# Altium schematic sheet [03] - 28PINS SCHEMATIC.SchDoc
size A2; PageSetup: Record=PageOptions|CenterHorizontal=True|CenterVertical=True|PrintScale=0.73|XCorrection=1.00|YCorrection=1.00|PrintKind=0|BorderSize=5000000|LeftOffset=0|BottomOffset=0|Orientation=2|PaperLength=1000|PaperWidth=1000|Scale=100|PaperSource=7|PrintQuality=-3|MediaType=1|DitherType=10|PrintScaleMode=1|PaperKind=A3|PaperIndex=8
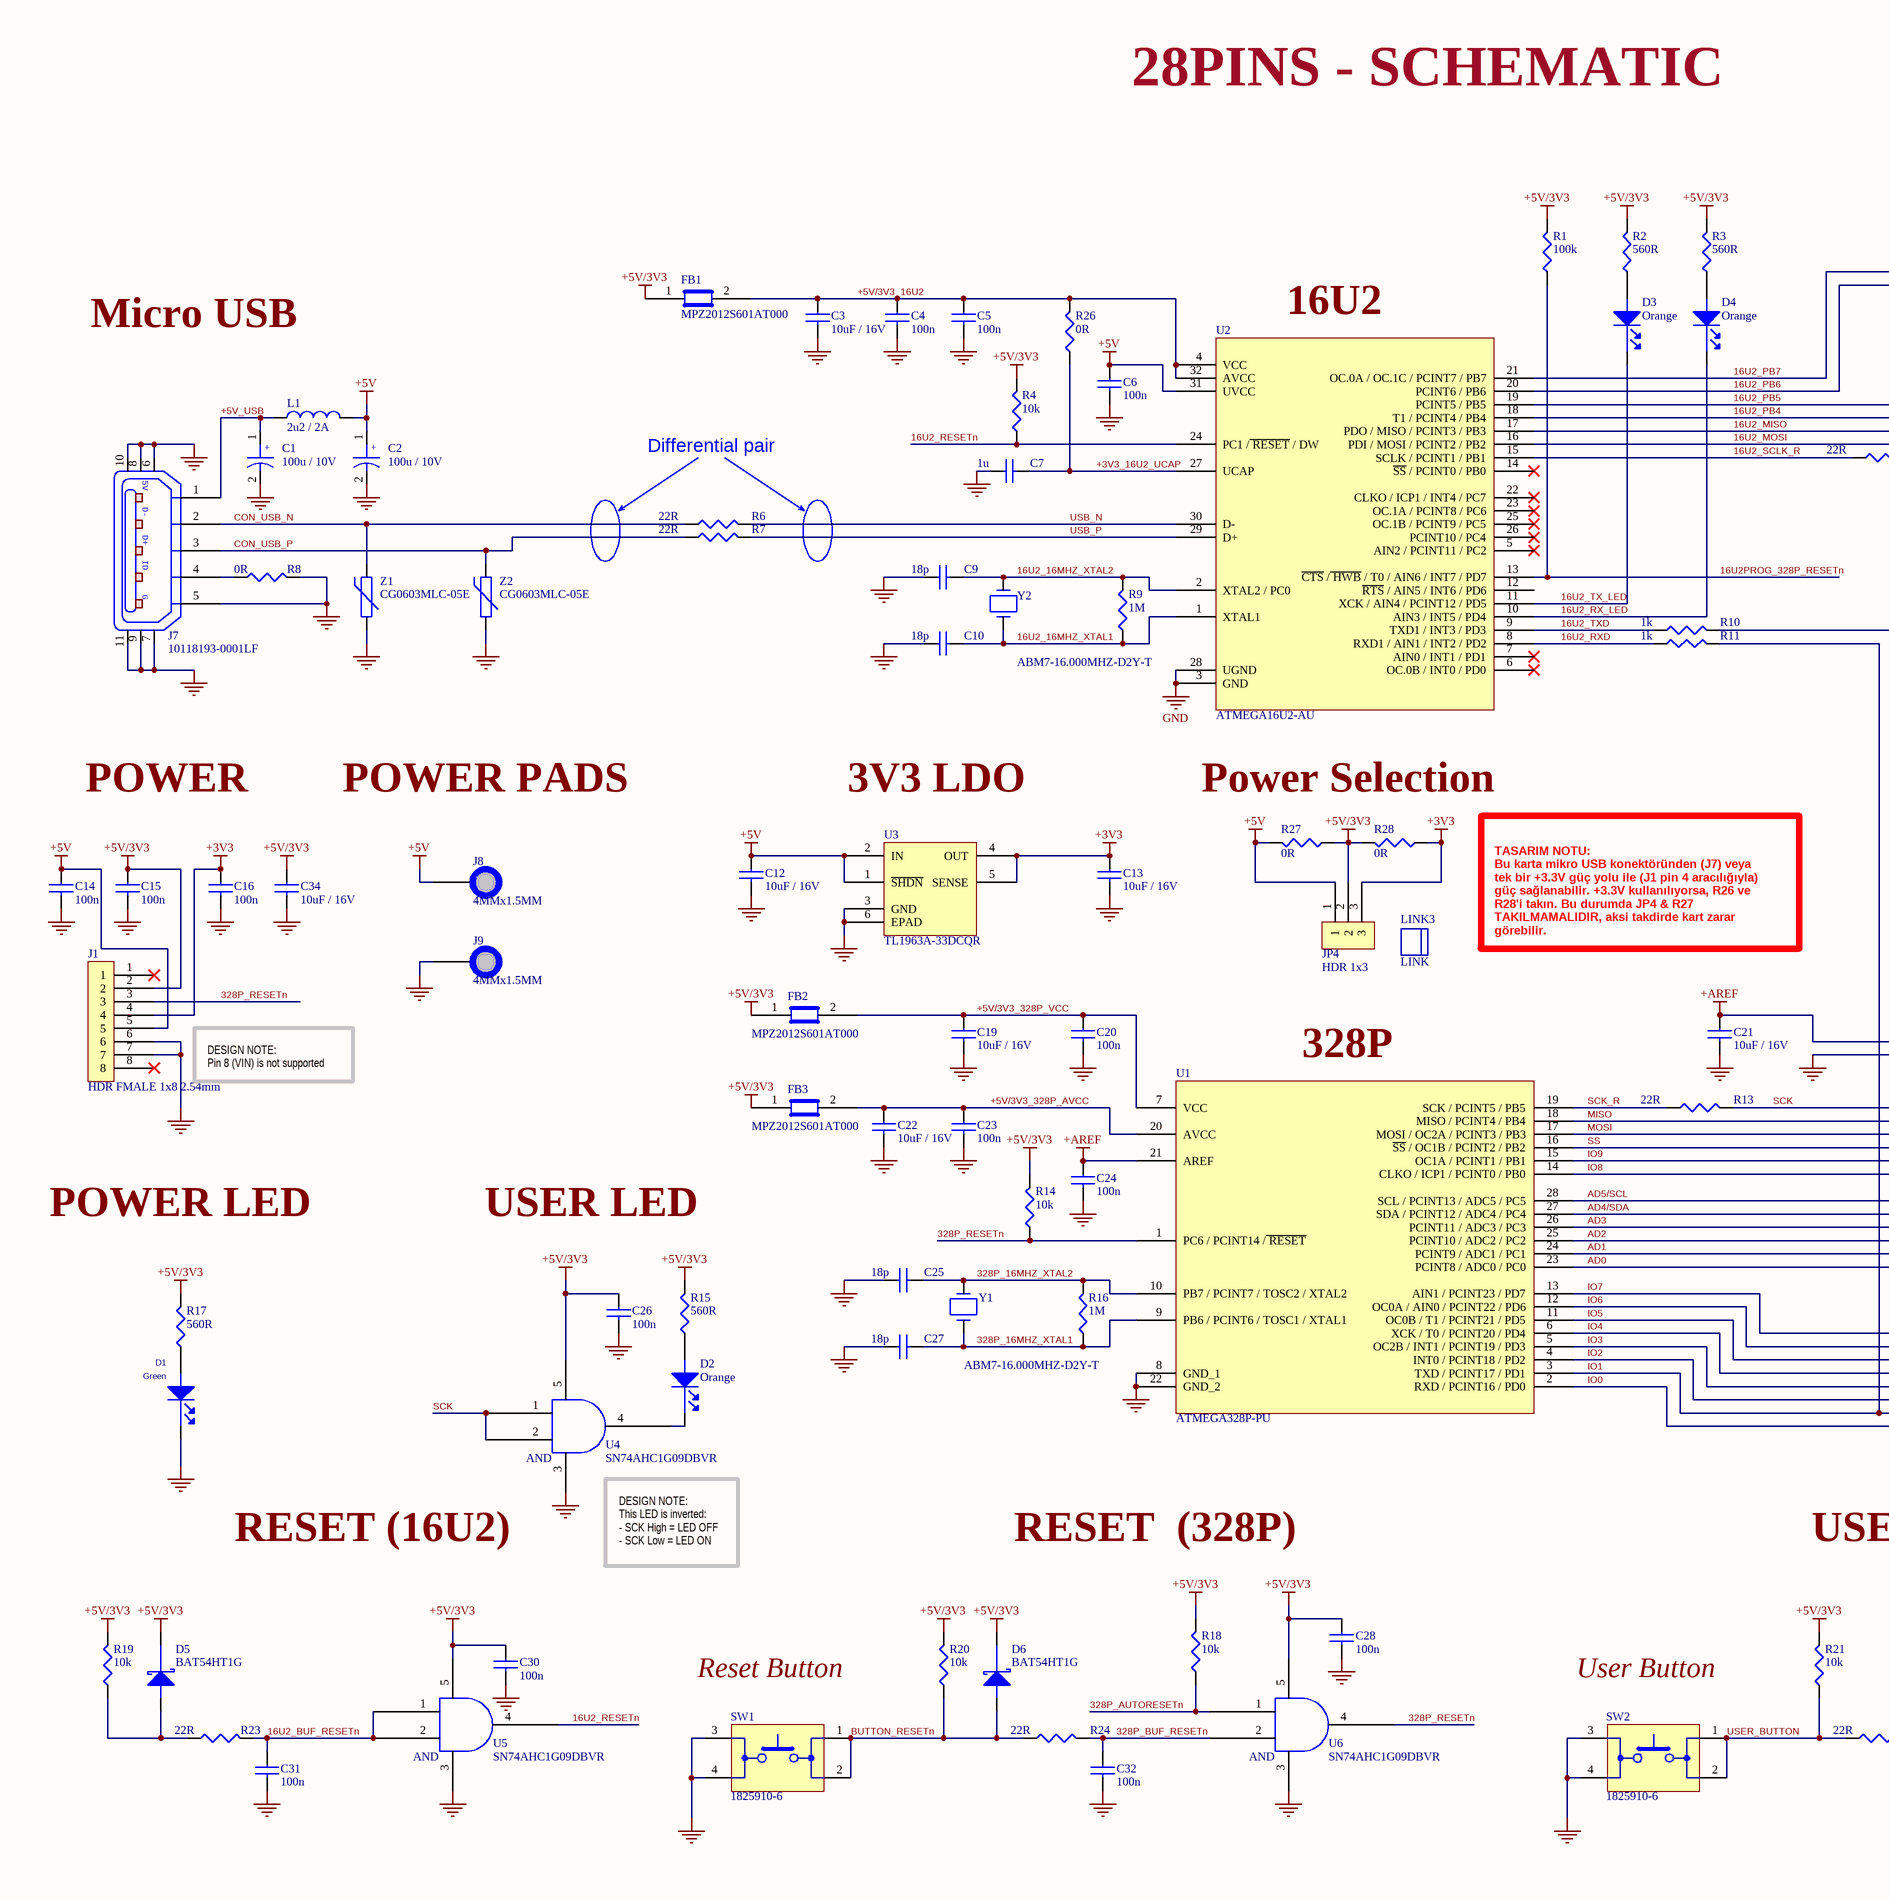
[diagram p0: [03] - 28PINS SCHEMATIC.SchDoc, left]
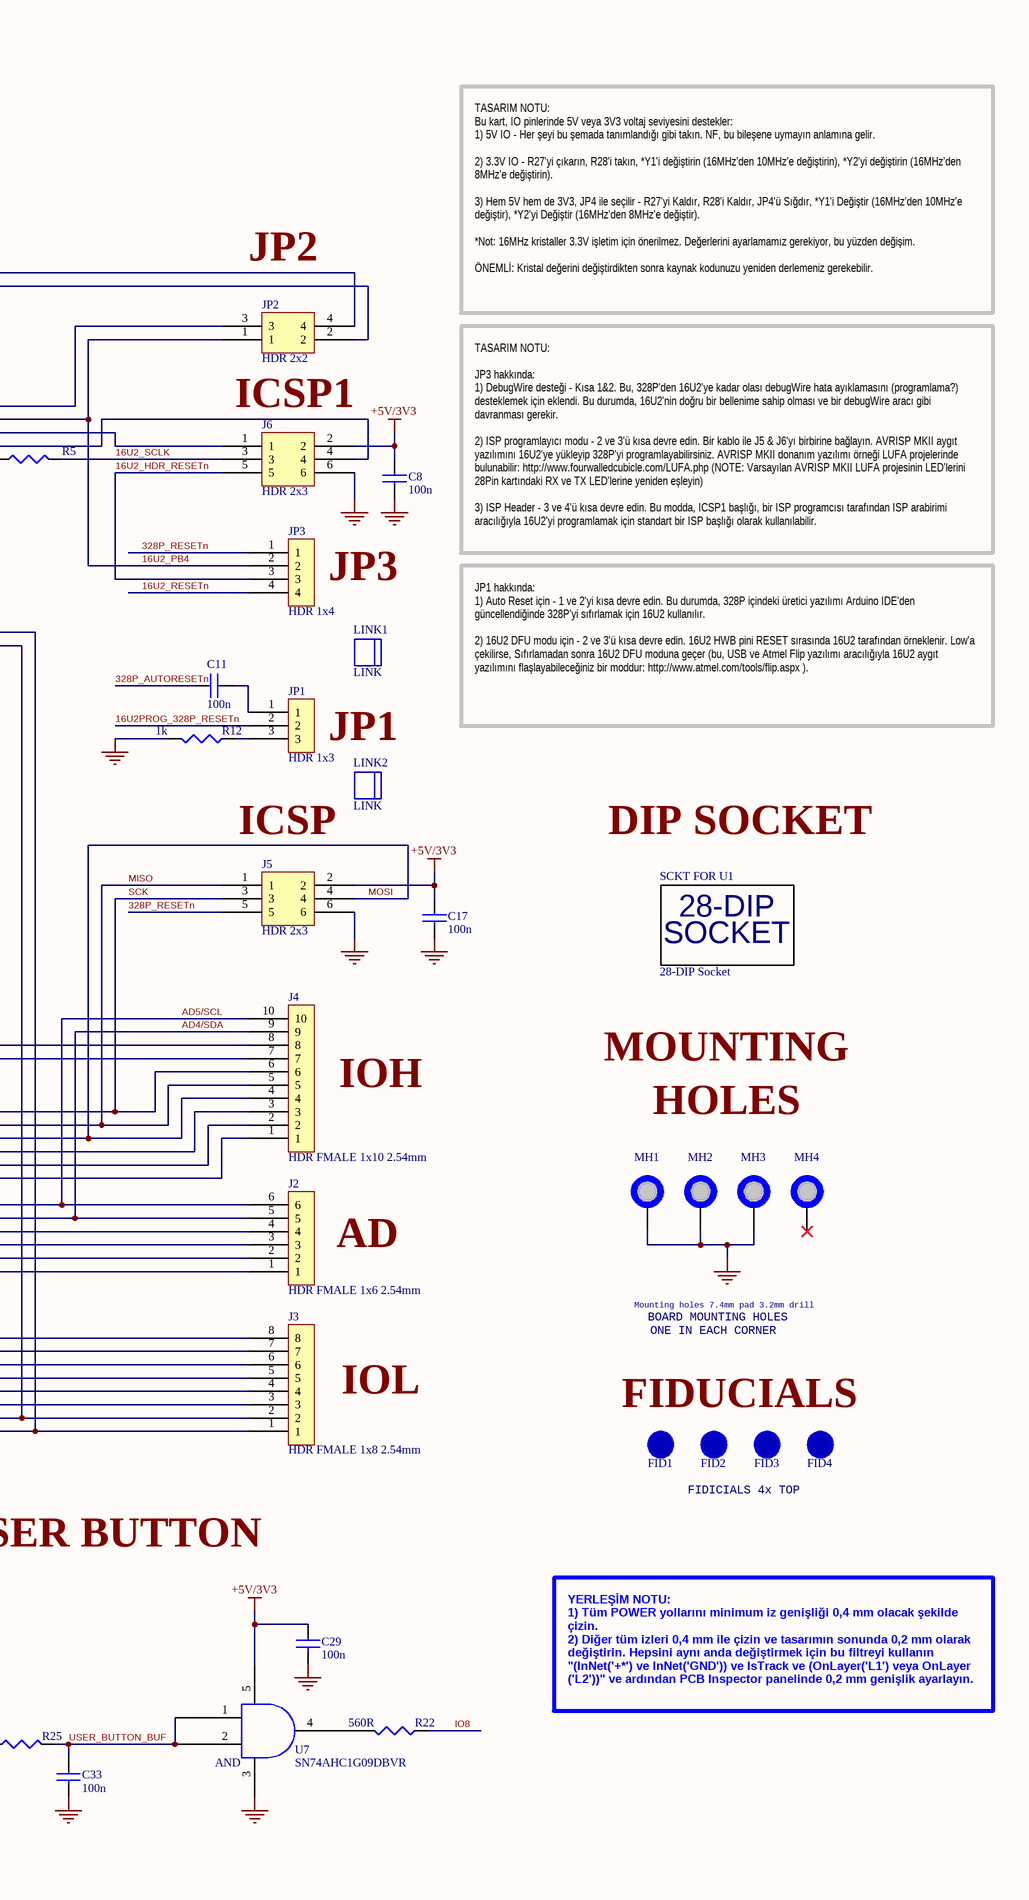
[diagram p1: [03] - 28PINS SCHEMATIC.SchDoc, right]

## Parts
C1  100u / 10V  [C_ALU_C_SIZE]
C2  100u / 10V  [C_ALU_C_SIZE]
C3  10uF / 16V  [C0805]
C4  100n  [C0805]
C5  100n  [C0805]
C6  100n  [C0805]
C7  1u  [C0805]
C8  100n  [C0805]
C9  18p  [C0805]
C10  18p  [C0805]
C11  100n  [C0805]
C12  10uF / 16V  [C0805]
C13  10uF / 16V  [C0805]
C14  100n  [C0805]
C15  100n  [C0805]
C16  100n  [C0805]
C17  100n  [C0805]
C19  10uF / 16V  [C0805]
C20  100n  [C0805]
C21  10uF / 16V  [C0805]
C22  10uF / 16V  [C0805]
C23  100n  [C0805]
C24  100n  [C0805]
C25  18p  [C0805]
C26  100n  [C0805]
C27  18p  [C0805]
C28  100n  [C0805]
C29  100n  [C0805]
C30  100n  [C0805]
C31  100n  [C0805]
C32  100n  [C0805]
C33  100n  [C0805]
C34  10uF / 16V  [C0805]
D1  Green  [LED_0603]
D2  Orange  [LED_0603]
D3  Orange  [LED_0603]
D4  Orange  [LED_0603]
D5  BAT54HT1G  [SOD323]
D6  BAT54HT1G  [SOD323]
FB1  MPZ2012S601AT000  [C0805]
FB2  MPZ2012S601AT000  [C0805]
FB3  MPZ2012S601AT000  [C0805]
FID1  FID_1MMC  [FID_40X120D]  (value not drawn)  (no BOM)
FID2  FID_1MMC  [FID_40X120D]  (value not drawn)  (no BOM)
FID3  FID_1MMC  [FID_40X120D]  (value not drawn)  (no BOM)
FID4  FID_1MMC  [FID_40X120D]  (value not drawn)  (no BOM)
J1  HDR FMALE 1x8 2.54mm  [Hdr_Female_1x8_2.54mm]
J2  HDR FMALE 1x6 2.54mm  [Hdr_Female_1x6_2.54mm]
J3  HDR FMALE 1x8 2.54mm  [Hdr_Female_1x8_2.54mm]
J4  HDR FMALE 1x10 2.54mm  [Hdr_Female_1x10_2.54mm]
J5  HDR 2x3  [HDR_2x3_2.54MM]
J6  HDR 2x3  [HDR_2x3_2.54MM]
J7  10118193-0001LF  [10118193]
J8  4MMx1.5MM  [PAD_WITH_HOLE_4MMx1.5MM]  (no BOM)
J9  4MMx1.5MM  [PAD_WITH_HOLE_4MMx1.5MM]  (no BOM)
JP1  HDR 1x3  [Hdr_1x3_2.54mm]
JP2  HDR 2x2  [HDR_2x2_2.54MM]
JP3  HDR 1x4  [HDR_1x4_2.54MM]
JP4  HDR 1x3  [Hdr_1x3_2.54mm]
L1  2u2 / 2A  [C1210_IND]
LINK1  LINK  (mechanical)
LINK2  LINK  (mechanical)
LINK3  LINK  (mechanical)
MH1  MH_7.4MMC_3.2MMD  [MH_7.4MMD_3.2MMD]  (value not drawn)  (no BOM)
MH2  MH_7.4MMC_3.2MMD  [MH_7.4MMD_3.2MMD]  (value not drawn)  (no BOM)
MH3  MH_7.4MMC_3.2MMD  [MH_7.4MMD_3.2MMD]  (value not drawn)  (no BOM)
MH4  MH_7.4MMNC_3.2MMD  [MH_7.4MMD_3.2MMD_NON_COPPER_NPTH]  (value not drawn)  (no BOM)
R1  100k  [R0805]
R2  560R  [R0805]
R3  560R  [R0805]
R4  10k  [R0805]
R5  22R  [R0805]
R6  22R  [R0805]
R7  22R  [R0805]
R8  0R  [R0805]
R9  1M  [R0805]
R10  1k  [R0805]
R11  1k  [R0805]
R12  1k  [R0805]
R13  22R  [R0805]
R14  10k  [R0805]
R15  560R  [R0805]
R16  1M  [R0805]
R17  560R  [R0805]
R18  10k  [R0805]
R19  10k  [R0805]
R20  10k  [R0805]
R21  10k  [R0805]
R22  560R  [R0805]
R23  22R  [R0805]
R24  22R  [R0805]
R25  22R  [R0805]
R26  0R  [R0805]
R27  0R  [R0805]
R28  0R  [R0805]
SCKT_FOR_U1  28-DIP Socket  [28_DIP_7.62mm_SOCKET]
SW1  1825910-6  [1825910-6]
SW2  1825910-6  [1825910-6]
U1  ATMEGA328P-PU  [28_DIP_7.62mm]
U2  ATMEGA16U2-AU  [TQFP32]
U3  TL1963A-33DCQR  [DCQ (R-PDSO-G6)]
U4  SN74AHC1G09DBVR  [DBV_SOT_23_5]
U5  SN74AHC1G09DBVR  [DBV_SOT_23_5]
U6  SN74AHC1G09DBVR  [DBV_SOT_23_5]
U7  SN74AHC1G09DBVR  [DBV_SOT_23_5]
Y1  ABM7-16.000MHZ-D2Y-T  [ABM7_v1_1_BIG]
Y2  ABM7-16.000MHZ-D2Y-T  [ABM7_v1_1_BIG]
Z1  CG0603MLC-05E  [R0603]
Z2  CG0603MLC-05E  [R0603]

## Nets
+3V3: C13.1 C16.1 J1.4 JP4.3 R28.1 U3.4(OUT) U3.5(SENSE)
+5V: C2.1 C6.1 C12.1 C14.1 J1.5 J8.1 JP4.1 L1.2 R27.2 U2.31(UVCC) U3.1(~{SHDN}) U3.2(IN)
+5V/3V3: C8.1 C15.1 C17.1 C26.1 C28.1 C29.1 C30.1 C34.1 D5.1(Cathode) D6.1(Cathode) FB1.1 FB2.1 FB3.1 J1.2 J5.2 J6.2 JP4.2 R1.2 R2.2 R3.2 R4.2 R14.2 R15.2 R17.2 R18.2 R19.2 R20.2 R21.2 R27.1 R28.2 U4.5(VCC) U5.5(VCC) U6.5(VCC) U7.5(VCC)
+AREF: C21.1 C24.1 J4.8 U1.21(AREF)
GND: C1.2 C2.2 C3.2 C4.2 C5.2 C6.2 C7.1 C8.2 C9.1 C10.1 C12.2 C13.2 C14.2 C15.2 C16.2 C17.2 C19.2 C20.2 C21.2 C22.2 C23.2 C24.2 C25.1 C26.2 C27.1 C28.2 C29.2 C30.2 C31.2 C32.2 C33.2 C34.2 D1.1(cathode) J1.6 J1.7 J4.7 J5.6 J6.6 J7.5(P5) J7.6 J7.7 J7.8 J7.9 J7.10 J7.11 J9.1 MH1.1 MH2.1 MH3.1 R8.2 R12.2 SW1.3(MECH1) SW1.4(MECH2) SW2.3(MECH1) SW2.4(MECH2) U1.8(GND_1) U1.22(GND_2) U2.3(GND) U2.28(UGND) U3.3(GND) U3.6(EPAD) U4.3(GND) U5.3(GND) U6.3(GND) U7.3(GND) Z1.1 Z2.1
16U2_16MHZ_XTAL1: C10.2 R9.1 U2.1(XTAL1) Y2.1
16U2_16MHZ_XTAL2: C9.2 R9.2 U2.2(XTAL2_/_PC0) Y2.2
16U2_BUF_RESETn: C31.1 R23.2 U5.1(A) U5.2(B)
16U2_HDR_RESETn: J6.5 JP3.3
16U2_MISO: J6.1 U2.17(PDO_/_MISO_/_PCINT3_/_PB3)
16U2_MOSI: J6.4 U2.16(PDI_/_MOSI_/_PCINT2_/_PB2)
16U2_PB4: JP2.1 JP3.2 U2.18(T1_/_PCINT4_/_PB4)
16U2_PB5: JP2.3 U2.19(PCINT5_/_PB5)
16U2_PB6: JP2.2 U2.20(PCINT6_/_PB6)
16U2_PB7: JP2.4 U2.21(OC.0A_/_OC.1C_/_PCINT7_/_PB7)
16U2_RESETn: JP3.4 R4.1 U2.24(PC1_/~{_RESET}_/_DW) U5.4(Y)
16U2_RX_LED: D4.1(cathode) U2.10(AIN3_/_INT5_/_PD4)
16U2_RXD: R11.1 U2.8(RXD1_/_AIN1_/_INT2_/_PD2)
16U2_SCLK: J6.3 R5.2
16U2_SCLK_R: R5.1 U2.15(SCLK_/_PCINT1_/_PB1)
16U2_TX_LED: D3.1(cathode) U2.11(XCK_/_AIN4_/_PCINT12_/_PD5)
16U2_TXD: R10.1 U2.9(TXD1_/_INT3_/_PD3)
16U2PROG_328P_RESETn: JP1.2 R1.1 U2.13(~{CTS}_/~{_HWB}_/_T0_/_AIN6_/_INT7_/_PD7)
328P_16MHZ_XTAL1: C27.2 R16.1 U1.9(PB6_/_PCINT6_/_TOSC1_/_XTAL1) Y1.1
328P_16MHZ_XTAL2: C25.2 R16.2 U1.10(PB7_/_PCINT7_/_TOSC2_/_XTAL2) Y1.2
328P_AUTORESETn: C11.1 R18.1 U6.1(A)
328P_BUF_RESETn: C32.1 R24.2 U6.2(B)
328P_RESETn: J1.3 J5.5 JP3.1 R14.1 U1.1(PC6_/_PCINT14_/~{_RESET}) U6.4(Y)
+3V3_16U2_UCAP: C7.2 R26.1 U2.27(UCAP)
+5V/3V3_16U2: C3.1 C4.1 C5.1 FB1.2 R26.2 U2.4(VCC) U2.32(AVCC)
+5V/3V3_328P_AVCC: C22.1 C23.1 FB3.2 U1.20(AVCC)
+5V/3V3_328P_VCC: C19.1 C20.1 FB2.2 U1.7(VCC)
+5V_USB: C1.1 J7.1(P1) L1.1
AD0: J2.1 U1.23(PCINT8_/_ADC0_/_PC0)
AD1: J2.2 U1.24(PCINT9_/_ADC1_/_PC1)
AD2: J2.3 U1.25(PCINT10_/_ADC2_/_PC2)
AD3: J2.4 U1.26(PCINT11_/_ADC3_/_PC3)
AD4/SDA: J2.5 J4.9 U1.27(SDA_/_PCINT12_/_ADC4_/_PC4)
AD5/SCL: J2.6 J4.10 U1.28(SCL_/_PCINT13_/_ADC5_/_PC5)
BUTTON_RESETn: D6.2(Anode) R20.1 R24.1 SW1.1 SW1.2
CON_USB_N: J7.2(P2) R6.1 Z1.2
CON_USB_P: J7.3(P3) R7.1 Z2.2
IO0: J3.1 R10.2 U1.2(RXD_/_PCINT16_/_PD0)
IO1: J3.2 R11.2 U1.3(TXD_/_PCINT17_/_PD1)
IO2: J3.3 U1.4(INT0_/_PCINT18_/_PD2)
IO3: J3.4 U1.5(OC2B_/_INT1_/_PCINT19_/_PD3)
IO4: J3.5 U1.6(XCK_/_T0_/_PCINT20_/_PD4)
IO5: J3.6 U1.11(OC0B_/_T1_/_PCINT21_/_PD5)
IO6: J3.7 U1.12(OC0A_/_AIN0_/_PCINT22_/_PD6)
IO7: J3.8 U1.13(AIN1_/_PCINT23_/_PD7)
IO8: J4.1 R22.1 U1.14(CLKO_/_ICP1_/_PCINT0_/_PB0)
IO9: J4.2 U1.15(OC1A_/_PCINT1_/_PB1)
MISO: J4.5 J5.1 U1.18(MISO_/_PCINT4_/_PB4)
MOSI: J4.4 J5.4 U1.17(MOSI_/_OC2A_/_PCINT3_/_PB3)
SCK: J4.6 J5.3 R13.2 U4.1(A) U4.2(B)
SCK_R: R13.1 U1.19(SCK_/_PCINT5_/_PB5)
SS: J4.3 U1.16(~{SS}_/_OC1B_/_PCINT2_/_PB2)
USB_N: R6.2 U2.30(D-)
USB_P: R7.2 U2.29(D+)
USER_BUTTON: R21.1 R25.1 SW2.1 SW2.2
USER_BUTTON_BUF: C33.1 R25.2 U7.1(A) U7.2(B)
NetC11_2: C11.2 JP1.1
NetD1_2: D1.2(ANODE) R17.1
NetD2_1: D2.1(cathode) U4.4(Y)
NetD2_2: D2.2(ANODE) R15.1
NetD3_2: D3.2(ANODE) R2.1
NetD4_2: D4.2(ANODE) R3.1
NetD5_2: D5.2(Anode) R19.1 R23.1
NetJ7_4: J7.4(P4) R8.1
NetJP1_3: JP1.3 R12.1
NetR22_2: R22.2 U7.4(Y)

Not connected (* = marked no-connect by the designer): J1 1* 8*; MH4 1*; U2 5(AIN2_/_PCINT11_/_PC2)* 6(OC.0B_/_INT0_/_PD0)* 7(AIN0_/_INT1_/_PD1)* 12(~{RTS}_/_AIN5_/_INT6_/_PD6) 14(~{SS}_/_PCINT0_/_PB0)* 22(CLKO_/_ICP1_/_INT4_/_PC7)* 23(OC.1A_/_PCINT8_/_PC6)* 25(OC.1B_/_PCINT9_/_PC5)* 26(PCINT10_/_PC4)*

## Notes on the sheet
- 28PINS - SCHEMATIC
- JP2
- Micro USB
- (near U2) 16U2
- TASARIM NOTU:
  Bu kart, IO pinlerinde 5V veya 3V3 voltaj seviyesini destekler:
  1) 5V IO - Her şeyi bu şemada tanımlandığı gibi takın. NF, bu bileşene uymayın anlamına gelir.
  2) 3.3V IO - R27'yi çıkarın, R28'i takın, *Y1'i değiştirin (16MHz'den 10MHz'e değiştirin), *Y2'yi değiştirin (16MHz'den 8MHz'e değiştirin).
  3) Hem 5V hem de 3V3, JP4 ile seçilir - R27'yi Kaldır, R28'i Kaldır, JP4'ü Sığdır, *Y1'i Değiştir (16MHz'den 10MHz'e değiştir), *Y2'yi Değiştir (16MHz'den 8MHz'e değiştir).
  *Not: 16MHz kristaller 3.3V işletim için önerilmez. Değerlerini ayarlamamız gerekiyor, bu yüzden değişim.
  ÖNEMLİ: Kristal değerini değiştirdikten sonra kaynak kodunuzu yeniden derlemeniz gerekebilir.
- ICSP1
- Differential pair
- TASARIM NOTU:
  JP3 hakkında:
  1) DebugWire desteği - Kısa 1&2. Bu, 328P'den 16U2'ye kadar olası debugWire hata ayıklamasını (programlama?) desteklemek için eklendi. Bu durumda, 16U2'nin doğru bir bellenime sahip olması ve bir debugWire aracı gibi davranması gerekir.
  2) ISP programlayıcı modu - 2 ve 3'ü kısa devre edin. Bir kablo ile J5 & J6'yı birbirine bağlayın. AVRISP MKII aygıt yazılımını 16U2'ye yükleyip 328P'yi programlayabilirsiniz. AVRISP MKII donanım yazılımı örneği LUFA projelerinde bulunabilir: http://www.fourwalledcubicle.com/LUFA.php (NOTE: Varsayılan AVRISP MKII LUFA projesinin LED'lerini 28Pin kartındaki RX ve TX LED'lerine yeniden eşleyin)
  3) ISP Header - 3 ve 4'ü kısa devre edin. Bu modda, ICSP1 başlığı, bir ISP programcısı tarafından ISP arabirimi aracılığıyla 16U2'yi programlamak için standart bir ISP başlığı olarak kullanılabilir.
- JP3
- JP1
- JP1 hakkında:
  1) Auto Reset için - 1 ve 2'yi kısa devre edin. Bu durumda, 328P içindeki üretici yazılımı Arduino IDE'den güncellendiğinde 328P'yi sıfırlamak için 16U2 kullanılır.
  2) 16U2 DFU modu için - 2 ve 3'ü kısa devre edin. 16U2 HWB pini RESET sırasında 16U2 tarafından örneklenir. Low'a çekilirse, Sıfırlamadan sonra 16U2 DFU moduna geçer (bu, USB ve Atmel Flip yazılımı aracılığıyla 16U2 aygıt yazılımını flaşlayabileceğiniz bir moddur: http://www.atmel.com/tools/flip.aspx ).
- POWER
- POWER PADS
- 3V3 LDO
- Power Selection
- ICSP
- DIP SOCKET
- TASARIM NOTU:
  Bu karta mikro USB konektöründen (J7) veya tek bir +3.3V güç yolu ile (J1 pin 4 aracılığıyla) güç sağlanabilir. +3.3V kullanılıyorsa, R26 ve R28'i takın. Bu durumda JP4 & R27 TAKILMAMALIDIR, aksi takdirde kart zarar görebilir.
- DESIGN NOTE:
  Pin 8 (VIN) is not supported
- (near U1) 328P
- MOUNTING
- IOH
- HOLES
- POWER LED
- USER LED
- AD
- Mounting holes 7.4mm pad 3.2mm drill
- BOARD MOUNTING HOLES
- ONE IN EACH CORNER
- IOL
- FIDUCIALS
- RESET (16U2)
- RESET  (328P)
- USER BUTTON
- FIDICIALS 4x TOP
- (near U4) DESIGN NOTE:
  This LED is inverted:
  - SCK High = LED OFF
  - SCK Low = LED ON
- Reset Button
- User Button
- YERLEŞİM NOTU:
  1) Tüm POWER yollarını minimum iz genişliği 0,4 mm olacak şekilde çizin.
  2) Diğer tüm izleri 0,4 mm ile çizin ve tasarımın sonunda 0,2 mm olarak değiştirin. Hepsini aynı anda değiştirmek için bu filtreyi kullanın
  "(InNet('+*') ve InNet('GND')) ve IsTrack ve (OnLayer('L1') veya OnLayer ('L2'))" ve ardından PCB Inspector panelinde 0,2 mm genişlik ayarlayın.
- Title:
- Document Name :
- Project Code :
- Author :
- Sheet
- of
- (in symbol 4828-3004-CP) 28-DIP; SOCKET
- (in symbol 10118193-0001LF) 5V; D-; D+; ID; G
- (in symbol EEE-1AA101WR) +
- (in symbol SN74AHC1G09DBVR) AND

## Library data of the parts
C1 C2 = EEE-1AA101WR: CAP ALUM 100UF 10V 20% SMD; Manufacturer: Panasonic Electronic Components; Capacitance: 100µF; Lifetime @ Temp.: 1000 Hrs @ 85°C; Ripple Current: 50mA; Surface Mount Land Size: 0.209" L x 0.209" W (5.30mm x 5.30mm); .Creator: MM; .Checked PCB: RF; Supplier 1: Digi-Key; Manufacturer Part Number: EEE-1AA101WR; RoHS: RoHS Compliant; Category: Capacitors; Stock 1: 50742; Pricing 1: 1=0.44, 10=0.345, 25=0.2904, 50=0.249, 100=0.2076, 250=0.15568, 500=0.13284 (USD); Packaging: Cut Tape (CT); Tolerance: ±20%; Voltage Rating: 10V; ESR (Equivalent Series Resistance): -; Operating Temperature: -40°C ~ 85°C; Type: -; Applications: Automotive; Impedance: -; Lead Spacing: -; Size / Dimension: 0.197" Dia (5.00mm); Height - Seated (Max): 0.213" (5.40mm); Mounting Type: Surface Mount; Package / Case: Radial, Can - SMD; ComponentLink1URL: http://industrial.panasonic.com/www-cgi/jvcr13pz.cgi?E+PZ+3+ABA0002+EEE1AA101WR+7+WW; ComponentLink1Description: http://industrial.panasonic.com/www-cgi/jvcr13pz.cgi?E+PZ+3+ABA0002+EEE1AA101WR+7+WW; Supplier Part Number 1: PCE3867CT-ND; .Checked SCH: RF
C3 C12 C13 C19 C21 C22 C34 = C2012X5R1C106M: CAP CER 10UF 16V 20% X5R 0805; Manufacturer: TDK Corporation; Manufacturer Part Number: C2012X5R1C106M/1.25; Capacitance: 10µF; .Checked PCB: used; Supplier 1: Digi-Key; Supplier Part Number 1: 445-4115-1-ND; RoHS: RoHS Compliant; Category: Capacitors; Stock 1: 66161; Pricing 1: 1=0.45, 10=0.357, 100=0.215, 250=0.16124, 500=0.1376, 1000=0.1075 (USD); Voltage - Rated: 16V; Tolerance: ±20%; Temperature Coefficient: X5R; Mounting Type: Surface Mount, MLCC; Operating Temperature: -55°C ~ 85°C; Applications: General Purpose; Ratings: -; Package / Case: 0805 (2012 Metric); Size / Dimension: 0.079" L x 0.049" W (2.00mm x 1.25mm); Height - Seated (Max): -; Thickness (Max): 0.039" (1.00mm); Lead Spacing: -; Features: -; Packaging: Cut Tape (CT); Lead Style: -; ComponentLink1URL: http://www.tdk.com/pdf/general_B11.pdf; ComponentLink1Description: http://www.tdk.com/pdf/general_B11.pdf; .Checked SCH: used
C4-C6 C8 C11 C14-C17 C20 C23 C24 C26 C28-C33 = C2012X7R1H104K085AA: CAP CER 0.1UF 50V 10% X7R 0805; Manufacturer: TDK Corporation; Capacitance: 0.1µF; .Creator: MM; .Checked PCB: RF; Supplier 1: Digi-Key; Manufacturer Part Number: C2012X7R1H104K085AA; RoHS: RoHS Compliant; Category: Capacitors; Stock 1: 818066; Pricing 1: 1=0.1, 10=0.066, 100=0.0303, 250=0.02476, 500=0.02118, 1000=0.0165 (USD); Packaging: Cut Tape (CT); Tolerance: ±10%; Voltage - Rated: 50V; Temperature Coefficient: X7R; Mounting Type: Surface Mount, MLCC; Operating Temperature: -55°C ~ 125°C; Applications: General Purpose; Ratings: -; Package / Case: 0805 (2012 Metric); Size / Dimension: 0.079" L x 0.049" W (2.00mm x 1.25mm); Height - Seated (Max): -; Thickness (Max): 0.037" (0.95mm); Lead Spacing: -; Features: -; Lead Style: -; ComponentLink1URL: http://product.tdk.com/en/catalog/datasheets/mlcc_commercial_general_en.pdf; ComponentLink1Description: http://product.tdk.com/en/catalog/datasheets/mlcc_commercial_general_en.pdf; Supplier Part Number 1: 445-7534-1-ND; .Checked SCH: RF
C7 = C2012X5R1E105K125AA: CAP CER 1UF 25V 10% X5R 0805; Manufacturer: TDK Corporation; Capacitance: 1µF; .Creator: MM; .Checked PCB: RF; Supplier 1: Digi-Key; Manufacturer Part Number: C2012X5R1E105K125AA; RoHS: RoHS Compliant; Category: Capacitors; Stock 1: 57052; Pricing 1: 1=0.16, 10=0.112, 100=0.0533, 250=0.04488, 500=0.03758, 1000=0.03025 (USD); Packaging: Cut Tape (CT); Tolerance: ±10%; Voltage - Rated: 25V; Temperature Coefficient: X5R; Mounting Type: Surface Mount, MLCC; Operating Temperature: -55°C ~ 85°C; Applications: General Purpose; Ratings: -; Package / Case: 0805 (2012 Metric); Size / Dimension: 0.079" L x 0.049" W (2.00mm x 1.25mm); Height - Seated (Max): -; Thickness (Max): 0.057" (1.45mm); Lead Spacing: -; Features: -; Lead Style: -; ComponentLink1URL: http://product.tdk.com/en/catalog/datasheets/mlcc_commercial_general_en.pdf; ComponentLink1Description: http://product.tdk.com/en/catalog/datasheets/mlcc_commercial_general_en.pdf; Supplier Part Number 1: 445-1419-1-ND; .Checked SCH: RF
C9 C10 C25 C27 = C0805C180J5GACTU: CAP CER 18PF 50V 5% NP0 0805; Manufacturer: Kemet; Temperature Coefficient: C0G, NP0; .Creator: MM; .Checked PCB: RF; Supplier 1: Digi-Key; Manufacturer Part Number: C0805C180J5GACTU; RoHS: RoHS Compliant; Category: Capacitors; Stock 1: 39241; Pricing 1: 1=0.11, 10=0.083, 25=0.0588, 50=0.045, 100=0.0381, 250=0.0312, 1000=0.0204 (USD); Packaging: Cut Tape (CT); Capacitance: 18pF; Tolerance: ±5%; Voltage - Rated: 50V; Mounting Type: Surface Mount, MLCC; Operating Temperature: -55°C ~ 125°C; Applications: General Purpose; Ratings: -; Package / Case: 0805 (2012 Metric); Size / Dimension: 0.079" L x 0.049" W (2.00mm x 1.25mm); Height - Seated (Max): -; Thickness (Max): 0.035" (0.88mm); Lead Spacing: -; Features: -; Lead Style: -; ComponentLink1URL: http://www.kemet.com/docfinder?Partnumber=C0805C180J5GACTU; ComponentLink1Description: http://www.kemet.com/docfinder?Partnumber=C0805C180J5GACTU; Supplier Part Number 1: 399-1112-1-ND; .Checked SCH: RF
D1 = LG L29K-G2J1-24-Z: LED SMARTLED GREEN 570NM 0603; Manufacturer: OSRAM Opto Semiconductors Inc; .Checked PCB: used; Current - Test: 2mA; Voltage - Forward (Vf) Typ: 1.7V; Luminous Flux @ Current - Test: 12 mlm; Millicandela Rating: 3.92mcd; Wavelength - Peak: 572nm; Lens Type: Diffused; Lens Style/Size: Rectangle with Flat Top, 1.3mm x 0.8mm; Viewing Angle: 160°; Regulator Topology: Positive Fixed; Voltage - Output: 2.5V; Voltage - Input: 2.6 V ~ 6 V; Voltage - Dropout (Typical): 0.16V @ 500mA; Number of Regulators: 1; Current - Output: 500mA; Current - Limit (Min): 600mA; .Checked SCH: used; Category: Optoelectronics; Supplier Part Number: 475-2709-1-ND; Family: LEDs - <75mA, Discre; Manufacturer Part Number: LG L29K-G2J1-24-Z; Price 1k [$]: 0.08744; Value: Green; Color: Green; Package / Case: 0603 (1608 Metric); Supplier: Digikey; Supplier 1: Digi-Key; Supplier Part Number 1: 475-2709-1-ND; RoHS: RoHS Compliant; Stock 1: 30318; Pricing 1: 1=0.16, 10=0.137, 100=0.1093, 250=0.09564, 500=0.08744 (USD); Wavelength - Dominant: 570nm; Size / Dimension: 1.70mm L x 0.80mm W; Height: 0.65mm; Mounting Type: Surface Mount; Packaging: Cut Tape (CT); ComponentLink1URL: http://catalog.osram-os.com/catalogue/catalogue.do;jsessionid=32CB61882C089EDD4B6D0A54E7E1F117?act=downloadFile&favOid=020000020000138e000100b6; ComponentLink1Description: http://catalog.osram-os.com/catalogue/catalogue.do;jsessionid=32CB61882C089EDD4B6D0A54E7E1F117?act=downloadFile&favOid=020000020000138e000100b6; Operating Temperature: -40°C ~ 125°C; Supplier Device Package: 6-TMLF® (1.6x1.6); ComponentLink2URL: http://www.micrel.com/_PDF/mic5353.pdf; ComponentLink2Description: http://www.micrel.com/_PDF/mic5353.pdf
D2-D4 = LO L29K-H2K1-24-Z: LED SMARTLED ORANGE 606NM 0603; Manufacturer: OSRAM Opto Semiconductors Inc; Millicandela Rating: 6.3mcd; Voltage - Forward (Vf) Typ: 1.8V; Current - Test: 2mA; Wavelength - Peak: 610nm; Viewing Angle: 160°; Lens Type: Diffused; Lens Style/Size: Rectangle with Flat Top, 1.3mm x 0.8mm; Luminous Flux @ Current - Test: 25 mlm; .Checked PCB: used; Supplier 1: Digi-Key; Supplier Part Number 1: 475-2740-1-ND; Manufacturer Part Number: LO L29K-H2K1-24-Z; RoHS: RoHS Compliant; Category: Optoelectronics; Stock 1: 15900; Pricing 1: 1=0.17, 10=0.141, 100=0.1127, 250=0.0986, 500=0.09016 (USD); Color: Orange; Wavelength - Dominant: 606nm; Package / Case: 0603 (1608 Metric); Size / Dimension: 1.70mm L x 0.80mm W; Height: 0.65mm; Mounting Type: Surface Mount; Packaging: Cut Tape (CT); ComponentLink1URL: http://catalog.osram-os.com/catalogue/catalogue.do;jsessionid=302CF83AF637AE24E40AEB0ADA267EDD?act=downloadFile&favOid=020000010003f9de000100b6; ComponentLink1Description: http://catalog.osram-os.com/catalogue/catalogue.do;jsessionid=302CF83AF637AE24E40AEB0ADA267EDD?act=downloadFile&favOid=020000010003f9de000100b6; .Checked SCH: used
D5 D6 = BAT54HT1G: DIODE SCHOTTKY 30V 0.2A SOD323; Manufacturer: Fairchild Semiconductor; Current - Average Rectified (Io): 200mA; Voltage - Forward (Vf) (Max) @ If: 800mV @ 100mA; Speed: Small Signal =< 200mA (Io), Any Speed; Reverse Recovery Time (trr): 5ns; Current - Reverse Leakage @ Vr: 2µA @ 25V; Capacitance @ Vr, F: 10pF @ 1V, 1MHz; Thermal Resistance: 600°C/W Ja; .Creator: MM; .Checked PCB: used; Supplier 1: Digi-Key; Manufacturer Part Number: BAT54HT1G; RoHS: RoHS Compliant; Category: Discrete Semiconductor Products; Stock 1: 11388; Pricing 1: 1=0.3, 10=0.276, 25=0.1984, 100=0.1543, 250=0.09696, 500=0.0826, 1000=0.05628 (USD); Packaging: Cut Tape (CT); Diode Type: Schottky; Voltage - DC Reverse (Vr) (Max): 30V; Mounting Type: Surface Mount; Package / Case: SC-76, SOD-323; Supplier Device Package: SOD-323; Operating Temperature - Junction: -55°C ~ 150°C; ComponentLink1URL: http://www.fairchildsemi.com/ds/BA/BAT54HT1G.pdf; ComponentLink1Description: http://www.fairchildsemi.com/ds/BA/BAT54HT1G.pdf; Supplier Part Number 1: BAT54HT1GCT-ND; .Checked SCH: used
FB1-FB3 = MPZ2012S601AT000: FERRITE CHIP BEAD 600 OHM SMD; Manufacturer: TDK Corporation; Impedance @ Frequency: 600 Ohm @ 100MHz; Current Rating: 2A; DC Resistance (DCR): 100 mOhm Max; Filter Type: Differential Mode - Single; .Creator: MM; .Checked PCB: RF; Supplier 1: Digi-Key; Manufacturer Part Number: MPZ2012S601AT000; RoHS: RoHS Compliant; Category: Filters; Stock 1: 200620; Pricing 1: 1=0.12, 10=0.101, 100=0.0574, 250=0.04528, 500=0.03824, 1000=0.03221 (USD); Packaging: Cut Tape (CT); Package / Case: 0805 (2012 Metric); Mounting Type: Surface Mount; Height (Max): 0.041" (1.05mm); Size / Dimension: 0.079" L x 0.049" W (2.00mm x 1.25mm); ComponentLink1URL: http://product.tdk.com/en/catalog/datasheets/beads_commercial_power_mpz_en.pdf; ComponentLink1Description: http://product.tdk.com/en/catalog/datasheets/beads_commercial_power_mpz_en.pdf; Supplier Part Number 1: 445-2206-1-ND; .Checked SCH: RF
FID1-FID4 = FID_1MMC: Fiducial 40mil Diameter, 120mil Mask; Supplier: Digikey
J1 J3 = M20-7820842: 08-WAY SIL VERT SOCKET L/FREE; Manufacturer: Harwin Inc; Connector Type: Receptacle; Number of Positions: 8; Number of Positions Loaded: All; Pitch: 0.100" (2.54mm); .Creator: MM; .Checked PCB: RF; Supplier 1: Digi-Key; Manufacturer Part Number: M20-7820842; RoHS: RoHS Compliant; Category: Connectors, Interconnects; Stock 1: 2070; Pricing 1: 1=1.1, 29=0.91207, 58=0.87397, 116=0.83603, 261=0.76, 522=0.684, 1015=0.608, 2523=0.551 (USD); Packaging: Tube; Contact Type: Female Socket; Number of Rows: 1; Row Spacing: -; Mounting Type: Through Hole; Termination: Solder; Fastening Type: -; Features: -; Contact Finish: Gold; Contact Finish Thickness: Flash; Color: Black; ComponentLink1URL: http://harwin.com/includes/pdfs/M20-782.pdf; ComponentLink1Description: http://harwin.com/includes/pdfs/M20-782.pdf; Supplier Part Number 1: 952-1823-ND; .Checked SCH: RF
J2 = M20-7820646: 06-WAY SIL VERT SOCKET L/FREE; Manufacturer: Harwin Inc; Connector Type: Receptacle; Number of Positions: 6; Number of Positions Loaded: All; Pitch: 0.100" (2.54mm); .Checked PCB: MM; Supplier 1: Digi-Key; Manufacturer Part Number: M20-7820646; RoHS: RoHS Compliant; Category: Connectors, Interconnects; Stock 1: 87; Pricing 1: 1=0.96, 38=0.79211, 76=0.75895, 114=0.72596, 266=0.66, 532=0.594, 1026=0.528, 2508=0.4785 (USD); Packaging: Tube; Contact Type: Female Socket; Number of Rows: 1; Row Spacing: -; Mounting Type: Through Hole; Termination: Solder; Fastening Type: -; Features: -; Contact Finish: Tin; Contact Finish Thickness: -; Color: Black; ComponentLink1URL: http://harwin.com/includes/pdfs/M20-782.pdf; ComponentLink1Description: http://harwin.com/includes/pdfs/M20-782.pdf; Supplier Part Number 1: 952-1809-ND; .Checked SCH: MM; .Creator: MM
J4 = M20-7821046: 10-WAY SIL VERT SOCKET L/FREE; Manufacturer: Harwin Inc; Connector Type: Receptacle; Number of Positions: 10; Number of Positions Loaded: All; Pitch: 0.100" (2.54mm); .Creator: MM; .Checked PCB: RF; Supplier 1: Digi-Key; Manufacturer Part Number: M20-7821046; RoHS: RoHS Compliant; Category: Connectors, Interconnects; Stock 1: 214; Pricing 1: 1=1.28, 23=1.12217, 46=1.05609, 69=1.01203, 115=0.968, 253=0.88, 506=0.792, 1012=0.704, 2507=0.638 (USD); Packaging: Tube; Contact Type: Female Socket; Number of Rows: 1; Row Spacing: -; Mounting Type: Through Hole; Termination: Solder; Fastening Type: -; Features: -; Contact Finish: Tin; Contact Finish Thickness: -; Color: Black; ComponentLink1URL: http://harwin.com/includes/pdfs/M20-782.pdf; ComponentLink1Description: http://harwin.com/includes/pdfs/M20-782.pdf; Supplier Part Number 1: 952-1847-ND; .Checked SCH: RF
J5 J6 = 67997-106HLF: CONN HEADER 6POS .100 STR 30AU; Manufacturer: FCI; Connector Type: Header, Unshrouded; Number of Positions: 6; Number of Positions Loaded: All; Pitch: 0.100" (2.54mm); .Creator: MM; .Checked PCB: RF; Supplier 1: Digi-Key; Manufacturer Part Number: 67997-106HLF; RoHS: RoHS Compliant; Category: Connectors, Interconnects; Stock 1: 1377; Pricing 1: 1=1.64, 10=1.489, 25=1.3976, 50=1.3368, 100=1.276, 250=1.15444, 500=1.0633, 1000=0.9114, 2500=0.85064 (USD); Packaging: Bulk; Contact Type: Male Pin; Number of Rows: 2; Row Spacing: 0.100" (2.54mm); Contact Mating Length: 0.230" (5.84mm); Mounting Type: Through Hole; Termination: Solder; Fastening Type: -; Features: -; Contact Finish: Gold or Gold, GXT™; Contact Finish Thickness: 30µin (0.76µm); Color: Black; ComponentLink1URL: http://portal.fciconnect.com/Comergent//fci/drawing/67996.pdf; ComponentLink1Description: http://portal.fciconnect.com/Comergent//fci/drawing/67996.pdf; Supplier Part Number 1: 609-3393-ND; .Checked SCH: RF
J7 = 10118193-0001LF: CONN USB MICRO B RECPT SMT R/A; Manufacturer: FCI; Connector Type: USB - micro B; Number of Contacts: 5; Gender: Receptacle; Specifications: USB 2.0; .Creator: MM; .Checked PCB: RF; Supplier 1: Digi-Key; Manufacturer Part Number: 10118193-0001LF; RoHS: RoHS Compliant; Category: Connectors, Interconnects; Stock 1: 28642; Pricing 1: 1=0.46, 10=0.433, 25=0.3712, 50=0.3156, 100=0.3032, 250=0.27224, 500=0.25988 (USD); Packaging: Cut Tape (CT); Mounting Type: Surface Mount, Right Angle, Horizontal; Features: Shielded, Solder Retention; Ingress Protection: -; ComponentLink1URL: http://portal.fciconnect.com/Comergent//fci/drawing/10118193.pdf; ComponentLink1Description: http://portal.fciconnect.com/Comergent//fci/drawing/10118193.pdf; Supplier Part Number 1: 609-4616-1-ND; .Checked SCH: MM
J8 J9 = PAD_WITH_HOLE_4MMx1.5MM: Pad with a hole 4mm x 1.5mm
JP1 JP4 = 68000-103HLF: BERGSTIK II .100" SR STRAIGHT; Manufacturer: FCI; Connector Type: Header, Unshrouded; Number of Positions: 3; Number of Positions Loaded: All; Pitch: 0.100" (2.54mm); .Creator: MM; .Checked PCB: used; Supplier 1: Digi-Key; Manufacturer Part Number: 68000-103HLF; RoHS: RoHS Compliant; Category: Connectors, Interconnects; Stock 1: 37214; Pricing 1: 1=0.15, 10=0.145, 25=0.108, 50=0.0924 (USD); Packaging: Bulk; Contact Type: Male Pin; Number of Rows: 1; Row Spacing: -; Contact Mating Length: 0.230" (5.84mm); Mounting Type: Through Hole; Termination: Solder; Fastening Type: -; Features: -; Contact Finish: Gold or Gold, GXT™; Contact Finish Thickness: 30µin (0.76µm); Color: Black; ComponentLink1URL: http://portal.fciconnect.com/Comergent//fci/drawing/68000.pdf; ComponentLink1Description: http://portal.fciconnect.com/Comergent//fci/drawing/68000.pdf; Supplier Part Number 1: 609-3461-ND; .Checked SCH: used
JP2 = 68602-204HLF: CONN HEADER 4POS .100 STR 15AU; Manufacturer: FCI; Connector Type: Header, Unshrouded; Number of Positions: 4; Number of Positions Loaded: All; Pitch: 0.100" (2.54mm); .Creator: MM; .Checked PCB: RF; Supplier 1: Digi-Key; Manufacturer Part Number: 68602-204HLF; RoHS: RoHS Compliant; Category: Connectors, Interconnects; Stock 1: 2795; Pricing 1: 1=0.34, 10=0.326, 25=0.2792, 50=0.2374, 100=0.2281, 250=0.20484, 500=0.19552, 1000=0.16293, 2500=0.14896 (USD); Packaging: Bulk; Contact Type: Male Pin; Number of Rows: 2; Row Spacing: 0.100" (2.54mm); Contact Mating Length: 0.230" (5.84mm); Mounting Type: Through Hole; Termination: Solder; Fastening Type: -; Features: -; Contact Finish: Gold or Gold, GXT™; Contact Finish Thickness: 15µin (0.38µm); Color: Black; ComponentLink1URL: http://portal.fciconnect.com/Comergent//fci/drawing/67996.pdf; ComponentLink1Description: http://portal.fciconnect.com/Comergent//fci/drawing/67996.pdf; Supplier Part Number 1: 609-3369-ND; .Checked SCH: RF
JP3 = 68001-204HLF: CONN HEADER 4POS .100 STR 15AU; Manufacturer: FCI; Connector Type: Header, Unshrouded; Number of Positions: 4; Number of Positions Loaded: All; Pitch: 0.100" (2.54mm); .Checked PCB: RF; Supplier 1: Digi-Key; Supplier Part Number 1: 609-3402-ND; Manufacturer Part Number: 68001-204HLF; RoHS: RoHS Compliant; Category: Connectors, Interconnects; Stock 1: 8754; Pricing 1: 1=0.7, 10=0.432, 100=0.2485, 250=0.21868, 500=0.1988, 1000=0.17892, 5000=0.12674 (USD); Contact Type: Male Pin; Number of Rows: 1; Row Spacing: -; Contact Mating Length: 0.230" (5.84mm); Mounting Type: Through Hole; Termination: Solder; Fastening Type: -; Features: -; Contact Finish: Gold; Contact Finish Thickness: 15µin (0.38µm); Color: Black; Packaging: Bulk; ComponentLink1URL: http://portal.fciconnect.com/res/en/pdffiles/doc_search/68000.pdf; ComponentLink1Description: http://portal.fciconnect.com/res/en/pdffiles/doc_search/68000.pdf; .Checked SCH: RF
L1 = L1210R2R2MDWIT: FIXED IND 2.2UH 2A 80 MOHM SMD; Manufacturer: Kemet; Type: Wirewound; Material - Core: Ferrite; Inductance: 2.2µH; Tolerance: ±20%; Shielding: Unshielded; DC Resistance (DCR): 80 mOhm; Frequency - Self Resonant: 190MHz; Frequency - Test: 100kHz; .Creator: MM; .Checked PCB: RF; Supplier 1: Digi-Key; Manufacturer Part Number: L1210R2R2MDWIT; RoHS: RoHS Compliant; Category: Inductors, Coils, Chokes; Stock 1: 3607; Pricing 1: 1=0.52, 10=0.466, 25=0.4372, 50=0.379, 100=0.3499, 250=0.33236, 500=0.30322 (USD); Packaging: Cut Tape (CT); Current Rating: 2A; Current - Saturation: -; Q @ Freq: -; Operating Temperature: -40°C ~ 105°C; Mounting Type: Surface Mount; Package / Case: 1210 (3225 Metric); Size / Dimension: 0.126" L x 0.098" W (3.20mm x 2.50mm); Height - Seated (Max): 0.106" (2.70mm); Supplier Device Package: 1210; ComponentLink1URL: http://www.kemet.com//kemet/web/homepage/kechome.nsf/vapubfile/Ferrite%20Products%20Catalog/$file/F3115.pdf; ComponentLink1Description: http://www.kemet.com//kemet/web/homepage/kechome.nsf/vapubfile/Ferrite%20Products%20Catalog/$file/F3115.pdf; Supplier Part Number 1: 399-9598-1-ND; .Checked SCH: RF
LINK1-LINK3 = QPC02SXGN-RC: CONN JUMPER SHORTING .100" GOLD; Manufacturer: Sullins Connector Solutions; Gender: Female Sockets; Number of Positions or Pins (Grid): 2 (1 x 2); Pitch: 0.100" (2.54mm); .Checked SCH: used; Supplier 1: Digi-Key; Supplier Part Number 1: S9337-ND; Manufacturer Part Number: QPC02SXGN-RC; RoHS: RoHS Compliant; Category: Connectors, Interconnects; Stock 1: 23274; Pricing 1: 1=0.11, 10=0.066, 25=0.0468, 50=0.0384, 100=0.033, 250=0.02792, 500=0.0258, 1000=0.0228, 2500=0.018 (USD); Type: Open Top; Height: 0.235" (5.97mm); Contact Finish: Gold; Contact Finish Thickness: Flash; Color: -; Packaging: Bulk; ComponentLink1URL: http://www.sullinscorp.com/drawings/284_SXGN_11510.pdf; ComponentLink1Description: http://www.sullinscorp.com/drawings/284_SXGN_11510.pdf
MH1-MH3 = MH_7.4MMC_3.2MMD: Mounting Hole 7.4mm Diameter, 3.2mm Drill; .Creator: MM
MH4 = MH_7.4MMNC_3.2MMD: Mounting Hole 7.4mm Diameter (Non Copper), 3.2mm Drill NPTH
R1 = RC0805FR-07100KL: RES SMD 100K OHM 1% 1/8W 0805; Manufacturer: Yageo; Power (Watts): 0.125W, 1/8W; Temperature Coefficient: ±100ppm/°C; .Creator: MM; .Checked PCB: RF; Supplier 1: Digi-Key; Manufacturer Part Number: RC0805FR-07100KL; RoHS: RoHS Compliant; Category: Resistors; Stock 1: 1604881; Pricing 1: 1=0.1, 10=0.021, 25=0.0148, 100=0.0084, 250=0.0064, 500=0.0051, 1000=0.00376, 2500=0.00326 (USD); Packaging: Cut Tape (CT); Resistance (Ohms): 100k; Tolerance: ±1%; Composition: Thick Film; Features: Moisture Resistant; Operating Temperature: -55°C ~ 155°C; Package / Case: 0805 (2012 Metric); Supplier Device Package: 0805; Size / Dimension: 0.079" L x 0.049" W (2.00mm x 1.25mm); Height: 0.024" (0.60mm); Number of Terminations: 2; ComponentLink1URL: http://www.yageo.com/documents/recent/PYu-RC_Group_51_RoHS_L_1.pdf; ComponentLink1Description: http://www.yageo.com/documents/recent/PYu-RC_Group_51_RoHS_L_1.pdf; Supplier Part Number 1: 311-100KCRCT-ND; .Checked SCH: RF
R2 R3 R15 R17 R22 = RC0805FR-07560RL: RES SMD 560 OHM 1% 1/8W 0805; Manufacturer: Yageo; Resistance (Ohms): 560; Power (Watts): 0.125W, 1/8W; Temperature Coefficient: ±100ppm/°C; .Creator: MM; .Checked PCB: RF; Supplier 1: Digi-Key; Manufacturer Part Number: RC0805FR-07560RL; RoHS: RoHS Compliant; Category: Resistors; Stock 1: 53313; Pricing 1: 1=0.1, 10=0.021, 25=0.0148, 100=0.0084, 250=0.0064, 500=0.0051, 1000=0.00376, 2500=0.00326 (USD); Packaging: Cut Tape (CT); Tolerance: ±1%; Composition: Thick Film; Features: Moisture Resistant; Operating Temperature: -55°C ~ 155°C; Package / Case: 0805 (2012 Metric); Supplier Device Package: 0805; Size / Dimension: 0.079" L x 0.049" W (2.00mm x 1.25mm); Height: 0.024" (0.60mm); Number of Terminations: 2; ComponentLink1URL: http://www.yageo.com/documents/recent/PYu-RC_Group_51_RoHS_L_1.pdf; ComponentLink1Description: http://www.yageo.com/documents/recent/PYu-RC_Group_51_RoHS_L_1.pdf; Supplier Part Number 1: 311-560CRCT-ND; .Checked SCH: RF
R4 R14 R18-R21 = RC0805FR-0710KL: RES SMD 10K OHM 1% 1/8W 0805; Manufacturer: Yageo; Power (Watts): 0.125W, 1/8W; Temperature Coefficient: ±100ppm/°C; .Creator: MM; .Checked PCB: RF; Supplier 1: Digi-Key; Manufacturer Part Number: RC0805FR-0710KL; RoHS: RoHS Compliant; Category: Resistors; Stock 1: 4094384; Pricing 1: 1=0.1, 10=0.021, 25=0.0148, 100=0.0084, 250=0.0064, 500=0.0051, 1000=0.00376, 2500=0.00326 (USD); Packaging: Cut Tape (CT); Resistance (Ohms): 10k; Tolerance: ±1%; Composition: Thick Film; Features: Moisture Resistant; Operating Temperature: -55°C ~ 155°C; Package / Case: 0805 (2012 Metric); Supplier Device Package: 0805; Size / Dimension: 0.079" L x 0.049" W (2.00mm x 1.25mm); Height: 0.024" (0.60mm); Number of Terminations: 2; ComponentLink1URL: http://www.yageo.com/documents/recent/PYu-RC_Group_51_RoHS_L_1.pdf; ComponentLink1Description: http://www.yageo.com/documents/recent/PYu-RC_Group_51_RoHS_L_1.pdf; Supplier Part Number 1: 311-10.0KCRCT-ND; .Checked SCH: RF
R5-R7 R13 R23-R25 = RC0805FR-0722RL: RES SMD 22 OHM 1% 1/8W 0805; Manufacturer: Yageo; Resistance (Ohms): 22; Power (Watts): 0.125W, 1/8W; Temperature Coefficient: ±100ppm/°C; .Creator: MM; .Checked PCB: RF; Supplier 1: Digi-Key; Manufacturer Part Number: RC0805FR-0722RL; RoHS: RoHS Compliant; Category: Resistors; Stock 1: 63849; Pricing 1: 1=0.1, 10=0.021, 25=0.0148, 100=0.0084, 250=0.0064, 500=0.0051, 1000=0.00376, 2500=0.00326 (USD); Packaging: Cut Tape (CT); Tolerance: ±1%; Composition: Thick Film; Features: Moisture Resistant; Operating Temperature: -55°C ~ 155°C; Package / Case: 0805 (2012 Metric); Supplier Device Package: 0805; Size / Dimension: 0.079" L x 0.049" W (2.00mm x 1.25mm); Height: 0.024" (0.60mm); Number of Terminations: 2; ComponentLink1URL: http://www.yageo.com/documents/recent/PYu-RC_Group_51_RoHS_L_1.pdf; ComponentLink1Description: http://www.yageo.com/documents/recent/PYu-RC_Group_51_RoHS_L_1.pdf; Supplier Part Number 1: 311-22.0CRCT-ND; .Checked SCH: RF
R8 R26-R28 = RC0805JR-070RL: RES 0.0 OHM 1/8W 0805 SMD; Manufacturer: Yageo; Resistance (Ohms): 0.0; Power (Watts): 0.125W, 1/8W; Tolerance: Jumper; .Checked PCB: RF; Category: Resistors; Supplier Part Number: 311-0.0ARCT-ND; Manufacturer Part Number: RC0805JR-070RL; Package / Case: 0805 (2012 Metric); Price 1k [$]: 0.01479; Value: 0R; .Checked SCH: RF; Supplier: Digikey; Supplier 1: Digi-Key; Supplier Part Number 1: 311-0.0ARCT-ND; RoHS: RoHS Compliant; Stock 1: 933202; Pricing 1: 10=0.017, 50=0.0126, 100=0.0096, 250=0.00716, 500=0.00528, 1000=0.00352 (USD); Composition: Thick Film; Features: -; Temperature Coefficient: -; Size / Dimension: 0.079" L x 0.049" W (2.00mm x 1.25mm); Height: 0.024" (0.60mm); Number of Terminations: 2; Packaging: Cut Tape (CT); ComponentLink1URL: http://www.yageo.com/documents/recent/PYu-RC0805_51_RoHS_L_4.pdf; ComponentLink1Description: http://www.yageo.com/documents/recent/PYu-RC0805_51_RoHS_L_4.pdf
R9 R16 = RC0805FR-071ML: RES SMD 1M OHM 1% 1/8W 0805; Manufacturer: Yageo; Power (Watts): 0.125W, 1/8W; Temperature Coefficient: ±100ppm/°C; .Creator: MM; .Checked PCB: RF; Supplier 1: Digi-Key; Manufacturer Part Number: RC0805FR-071ML; RoHS: RoHS Compliant; Category: Resistors; Stock 1: 449644; Pricing 1: 1=0.1, 10=0.021, 25=0.0148, 100=0.0084, 250=0.0064, 500=0.0051, 1000=0.00376, 2500=0.00326 (USD); Packaging: Cut Tape (CT); Resistance (Ohms): 1M; Tolerance: ±1%; Composition: Thick Film; Features: Moisture Resistant; Operating Temperature: -55°C ~ 155°C; Package / Case: 0805 (2012 Metric); Supplier Device Package: 0805; Size / Dimension: 0.079" L x 0.049" W (2.00mm x 1.25mm); Height: 0.024" (0.60mm); Number of Terminations: 2; ComponentLink1URL: http://www.yageo.com/documents/recent/PYu-RC_Group_51_RoHS_L_1.pdf; ComponentLink1Description: http://www.yageo.com/documents/recent/PYu-RC_Group_51_RoHS_L_1.pdf; Supplier Part Number 1: 311-1.00MCRCT-ND; .Checked SCH: RF
R10-R12 = RC0805FR-071KL: RES SMD 1K OHM 1% 1/8W 0805; Manufacturer: Yageo; Power (Watts): 0.125W, 1/8W; Temperature Coefficient: ±100ppm/°C; .Creator: MM; .Checked PCB: RF; Supplier 1: Digi-Key; Manufacturer Part Number: RC0805FR-071KL; RoHS: RoHS Compliant; Category: Resistors; Stock 1: 3497185; Pricing 1: 1=0.1, 10=0.021, 25=0.0148, 100=0.0084, 250=0.0064, 500=0.0051, 1000=0.00376, 2500=0.00326 (USD); Packaging: Cut Tape (CT); Resistance (Ohms): 1k; Tolerance: ±1%; Composition: Thick Film; Features: Moisture Resistant; Operating Temperature: -55°C ~ 155°C; Package / Case: 0805 (2012 Metric); Supplier Device Package: 0805; Size / Dimension: 0.079" L x 0.049" W (2.00mm x 1.25mm); Height: 0.024" (0.60mm); Number of Terminations: 2; ComponentLink1URL: http://www.yageo.com/documents/recent/PYu-RC_Group_51_RoHS_L_1.pdf; ComponentLink1Description: http://www.yageo.com/documents/recent/PYu-RC_Group_51_RoHS_L_1.pdf; Supplier Part Number 1: 311-1.00KCRCT-ND; .Checked SCH: RF
SCKT_FOR_U1 = 4828-3004-CP: CONN IC DIP SOCKET 28POS TIN; Manufacturer: 3M; Number of Positions or Pins (Grid): 28 (2 x 14); Pitch - Mating: 0.100" (2.54mm); Material Flammability Rating: UL94 V-0; Current Rating: 1A; .Creator: MM; .Checked PCB: RF; Supplier 1: Digi-Key; Manufacturer Part Number: 4828-3004-CP; RoHS: RoHS Compliant; Category: Connectors, Interconnects; Stock 1: 6559; Pricing 1: 1=0.77, 10=0.72, 25=0.648, 50=0.576, 100=0.552, 250=0.504, 500=0.48, 1000=0.396, 2500=0.36 (USD); Packaging: Tube; Type: DIP, 0.3" (7.62mm) Row Spacing; Contact Finish - Mating: Tin; Contact Finish Thickness - Mating: 35µin (0.90µm); Contact Material - Mating: Phosphor Bronze; Mounting Type: Through Hole; Features: Open Frame; Termination: Solder; Pitch - Post: 0.100" (2.54mm); Contact Finish - Post: Tin; Contact Finish Thickness - Post: 35µin (0.90µm); Contact Material - Post: Phosphor Bronze; Housing Material: Polyester, Glass Filled; Operating Temperature: -25°C ~ 85°C; Termination Post Length: -; Contact Resistance: -; ComponentLink1URL: http://multimedia.3m.com/mws/mediawebserver?66666UuZjcFSLXTt4X&Em8&aEVuQEcuZgVs6EVs6E666666--; ComponentLink1Description: http://multimedia.3m.com/mws/mediawebserver?66666UuZjcFSLXTt4X&Em8&aEVuQEcuZgVs6EVs6E666666--; Supplier Part Number 1: 3M5480-ND; .Checked SCH: RF
SW1 SW2 = 1825910-6: SWITCH TACTILE SPST-NO 0.05A 24V; Manufacturer: TE Connectivity; Switch Function: Off-Mom; Contact Rating @ Voltage: 0.05A @ 24VDC; Actuator Type: Standard; Actuator Height off PCB, from Pins: 5.00mm; Actuator Orientation: Top Actuated; Outline: 6.00mm x 6.00mm; Illumination: Non-Illuminated; Operating Force: 160gf; Actuator Material: Polybutylene Terephthalate (PBT); Switch Travel: 0.25mm; Mechanical Life: 100,000 Cycles; .Creator: MM; .Checked PCB: RF; Supplier 1: Digi-Key; Manufacturer Part Number: 1825910-6; RoHS: RoHS Compliant; Category: Switches; Stock 1: 181823; Pricing 1: 1=0.1, 10=0.095, 25=0.0912, 50=0.088, 100=0.0831, 250=0.07824, 500=0.07498, 1000=0.05705 (USD); Packaging: Bulk; Circuit: SPST-NO; Mounting Type: Through Hole; Termination Style: PC Pin; Illumination Voltage (Nominal): -; Illumination Type, Color: -; Ingress Protection: -; Features: -; Operating Temperature: -35°C ~ 85°C; ComponentLink1URL: http://www.te.com/commerce/DocumentDelivery/DDEController?Action=srchrtrv&DocNm=1825910&DocType=Customer+Drawing&DocLang=English; ComponentLink1Description: http://www.te.com/commerce/DocumentDelivery/DDEController?Action=srchrtrv&DocNm=1825910&DocType=Customer+Drawing&DocLang=English; Supplier Part Number 1: 450-1650-ND; .Checked SCH: RF
U1 = ATMEGA328P-PU: IC MCU 8BIT 32KB FLASH 28DIP; Manufacturer: Atmel; Core Processor: AVR; Core Size: 8-Bit; Speed: 20MHz; Connectivity: I²C, SPI, UART/USART; Peripherals: Brown-out Detect/Reset, POR, PWM, WDT; Number of I/O: 23; Program Memory Size: 32KB (16K x 16); EEPROM Size: 1K x 8; RAM Size: 2K x 8; Voltage - Supply (Vcc/Vdd): 1.8 V ~ 5.5 V; Data Converters: A/D 6x10b; Oscillator Type: Internal; .Creator: MM; .Checked PCB: RF; Supplier 1: Digi-Key; Manufacturer Part Number: ATMEGA328P-PU; RoHS: RoHS Compliant; Category: Integrated Circuits (ICs); Stock 1: 47234; Pricing 1: 1=3.7, 10=3.305, 100=2.7103, 250=2.44588, 500=2.19468, 1000=1.85094 (USD); Packaging: Tube; Program Memory Type: FLASH; Operating Temperature: -40°C ~ 85°C; Package / Case: 28-DIP (0.300", 7.62mm); Supplier Device Package: 28-PDIP; ComponentLink1URL: http://www.atmel.com/images/atmel-8271-8-bit-avr-microcontroller-atmega48a-48pa-88a-88pa-168a-168pa-328-328p_datasheet_summary.pdf; ComponentLink1Description: http://www.atmel.com/images/atmel-8271-8-bit-avr-microcontroller-atmega48a-48pa-88a-88pa-168a-168pa-328-328p_datasheet_summary.pdf; Supplier Part Number 1: ATMEGA328P-PU-ND; .Checked SCH: RF
U2 = ATMEGA16U2-AU: IC MCU 8BIT 16KB FLASH 32TQFP; Manufacturer: Atmel; Core Processor: AVR; Core Size: 8-Bit; Speed: 16MHz; Connectivity: SPI, UART/USART, USB; Peripherals: Brown-out Detect/Reset, POR, PWM, WDT; Number of I/O: 22; Program Memory Size: 16KB (8K x 16); EEPROM Size: 512 x 8; Voltage - Supply (Vcc/Vdd): 2.7 V ~ 5.5 V; Oscillator Type: Internal; .Creator: MM; .Checked PCB: RF; Supplier 1: Digi-Key; Manufacturer Part Number: ATMEGA16U2-AU; RoHS: RoHS Compliant; Category: Integrated Circuits (ICs); Stock 1: 8549; Pricing 1: 1=4.35, 10=3.881, 25=3.4932, 100=3.1826, 250=2.87212, 500=2.57716, 1000=2.1735 (USD); Packaging: Tray; Program Memory Type: FLASH; RAM Size: 512 x 8; Data Converters: -; Operating Temperature: -40°C ~ 85°C; Package / Case: 32-TQFP; Supplier Device Package: 32-TQFP (7x7); ComponentLink1URL: http://www.atmel.com/Images/7799s.pdf; ComponentLink1Description: http://www.atmel.com/Images/7799s.pdf; Supplier Part Number 1: ATMEGA16U2-AU-ND; .Checked SCH: RF
U3 = TL1963A-33DCQR: IC REG LDO 3.3V 1.5A SOT223-6; Manufacturer: Texas Instruments; Regulator Topology: Positive Fixed; Voltage - Dropout (Typical): 0.34V @ 1.5A; Number of Regulators: 1; Voltage - Input: Up to 20V; Current - Limit (Min): 1.6A; .Creator: MM; .Checked PCB: RF; Supplier 1: Digi-Key; Manufacturer Part Number: TL1963A-33DCQR; RoHS: RoHS Compliant; Category: Integrated Circuits (ICs); Stock 1: 1690; Pricing 1: 1=3.11, 10=2.786, 25=2.5056, 100=2.2788, 250=2.0628, 500=1.8468, 750=1.674, 1000=1.35 (USD); Packaging: Cut Tape (CT); Voltage - Output: 3.3V; Current - Output: 1.5A; Operating Temperature: -40°C ~ 125°C; Mounting Type: Surface Mount; Package / Case: SOT-223-6; Supplier Device Package: SOT-223-6; ComponentLink1URL: http://www.ti.com/lit/ds/symlink/tl1963a.pdf; ComponentLink1Description: http://www.ti.com/lit/ds/symlink/tl1963a.pdf; Supplier Part Number 1: 296-24534-1-ND; .Checked SCH: RF
U4-U7 = SN74AHC1G09DBVR: IC GATE AND SGL 2INP SOT23-5; Manufacturer: Texas Instruments; Logic Type: AND Gate; Number of Circuits: 1; Number of Inputs: 2; Voltage - Supply: 2 V ~ 5.5 V; Current - Quiescent (Max): 1µA; Current - Output High, Low: -, 8mA; Logic Level - Low: 0.5 V ~ 1.65 V; Logic Level - High: 1.5 V ~ 3.85 V; Max Propagation Delay @ V, Max CL: 7.5ns @ 5V, 50pF; .Creator: MM; .Checked PCB: used; Supplier 1: Digi-Key; Manufacturer Part Number: SN74AHC1G09DBVR; RoHS: RoHS Compliant; Category: Integrated Circuits (ICs); Stock 1: 3468; Pricing 1: 1=0.49, 10=0.345, 25=0.2836, 100=0.2265, 250=0.165, 500=0.134, 1000=0.103 (USD); Features: Open Drain; Operating Temperature: -55°C ~ 125°C; Mounting Type: Surface Mount; Supplier Device Package: SOT-23-5; Package / Case: SC-74A, SOT-753; Packaging: Cut Tape (CT); ComponentLink1URL: http://www.ti.com/lit/ds/symlink/sn74ahc1g09.pdf; ComponentLink1Description: http://www.ti.com/lit/ds/symlink/sn74ahc1g09.pdf; Supplier Part Number 1: 296-29202-1-ND; .Checked SCH: used
Y1 Y2 = ABM7-16.000MHZ-D2Y-T: CRYSTAL 16MHZ 18PF SMD; Manufacturer: Abracon LLC; Frequency Stability: ±30ppm; Frequency Tolerance: ±20ppm; ESR (Equivalent Series Resistance): 50 Ohm; Operating Mode: Fundamental; .Creator: MM; .Checked PCB: RF; Supplier 1: Digi-Key; Manufacturer Part Number: ABM7-16.000MHZ-D2Y-T; RoHS: RoHS Compliant; Category: Crystals and Oscillators; Stock 1: 5861; Pricing 1: 1=0.96, 10=0.847, 50=0.791, 100=0.7, 500=0.6615 (USD); Packaging: Cut Tape (CT); Type: MHz Crystal; Frequency: 16MHz; Load Capacitance: 18pF; Operating Temperature: -40°C ~ 85°C; Ratings: -; Mounting Type: Surface Mount; Package / Case: 2-SMD; Size / Dimension: 0.236" L x 0.138" W (6.00mm x 3.50mm); Height: 0.055" (1.40mm); ComponentLink1URL: http://www.abracon.com/Resonators/abm7.pdf; ComponentLink1Description: http://www.abracon.com/Resonators/abm7.pdf; Supplier Part Number 1: 535-9840-1-ND; .Checked SCH: RF
Z1 Z2 = CG0603MLC-05E: VARISTOR 0603; Manufacturer: Bourns Inc.; Number of Circuits: 1; Maximum DC Volts: 5VDC; .Creator: MM; .Checked PCB: RF; Supplier 1: Digi-Key; Manufacturer Part Number: CG0603MLC-05E; RoHS: RoHS Compliant; Category: Circuit Protection; Stock 1: 104704; Pricing 1: 1=0.19, 10=0.177, 25=0.164, 50=0.158, 100=0.1472, 250=0.13104, 500=0.1092, 1000=0.10348, 2500=0.09256 (USD); Packaging: Cut Tape (CT); Varistor Voltage (Min): -; Varistor Voltage (Typ): -; Varistor Voltage (Max): -; Current - Surge: -; Maximum AC Volts: -; Energy: -; Package / Case: 0603 (1608 Metric); Mounting Type: Surface Mount, MLCV; ComponentLink1URL: http://www.bourns.com/data/global/pdfs/MLC.pdf; ComponentLink1Description: http://www.bourns.com/data/global/pdfs/MLC.pdf; Supplier Part Number 1: CG0603MLC-05ECT-ND; .Checked SCH: RF